# EAGLE design killbox (EAGLE 7.1.0)
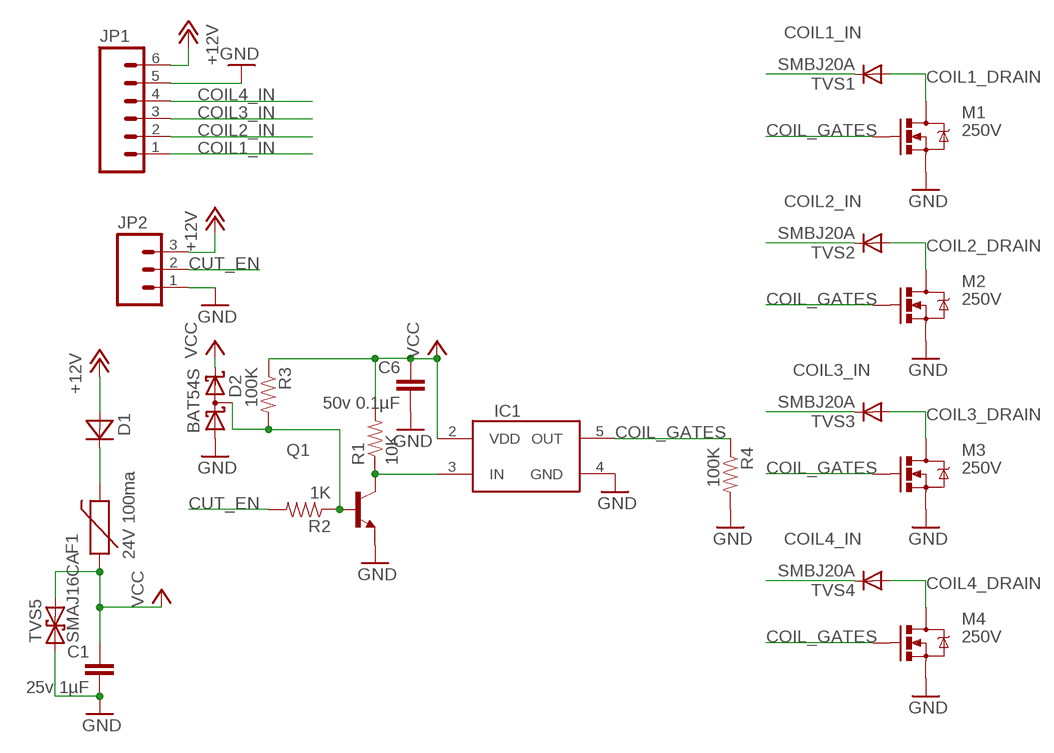
[diagram p0: schematic, sheet 1]

## Parts
C1  25v 1µF  CAP0603-CAP  [0603-CAP]
C6  50v 0.1µF  CAP0603-CAP  [0603-CAP]
D1  MBRA340T3  [SMA]
D2  BAT54S  [SOT23]
F1  24V 100ma  PTCSMD  [PTC-1206]
IC1  MCP1416  [SOT23-5]
JP1  M063.5MM-6  [SCREWTERMINAL-3.5MM-6]
JP2  M03-SCREW-5MM  [SCREWTERMINAL-5MM-3]
M1  250V  MOSFET-NCHANNELFDD8780  [DPAK]
M2  250V  MOSFET-NCHANNELFDD8780  [DPAK]
M3  250V  MOSFET-NCHANNELFDD8780  [DPAK]
M4  250V  MOSFET-NCHANNELFDD8780  [DPAK]
Q1  MMBT2222ALT1-NPN-SOT23-BEC  [SOT23-BEC]
R1  10K  RESISTOR0603-RES  [0603-RES]
R2  1K  RESISTOR0603-RES  [0603-RES]
R3  100K  RESISTOR0603-RES  [0603-RES]
R4  100K  RESISTOR0603-RES  [0603-RES]
TVS1  SMBJ20A  DIODESMB  [SMB-DIODE]
TVS2  SMBJ20A  DIODESMB  [SMB-DIODE]
TVS3  SMBJ20A  DIODESMB  [SMB-DIODE]
TVS4  SMBJ20A  DIODESMB  [SMB-DIODE]
TVS5  SMAJ16CA  TVS  [SMA-DIODE]

## Nets
+12V: D1.A JP1.6 JP2.3
COIL1_DRAIN [HV]: M1.4(D) TVS1.A
COIL1_IN [HV]: JP1.1 TVS1.C
COIL2_DRAIN [HV]: M2.4(D) TVS2.A
COIL2_IN [HV]: JP1.2 TVS2.C
COIL3_DRAIN [HV]: M3.4(D) TVS3.A
COIL3_IN [HV]: JP1.3 TVS3.C
COIL4_DRAIN [HV]: M4.4(D) TVS4.A
COIL4_IN [HV]: JP1.4 TVS4.C
COIL_GATES: IC1.5(OUT) M1.1(G) M2.1(G) M3.1(G) M4.1(G) R4.1
CUT_EN: JP2.2 R2.2
GND: C1.2 C6.2 D2.1(A1) IC1.4(GND) JP1.5 JP2.1 M1.3(S) M2.3(S) M3.3(S) M4.3(S) Q1.E R4.2 TVS5.A
N$1: IC1.3(IN) Q1.C R1.1
N$2: D2.3(C1A2) Q1.B R2.1 R3.2
N$11: D1.C F1.2
VCC: C1.1 C6.1 D2.2(C2) F1.1 IC1.2(VDD) R1.2 R3.1 TVS5.C

## Library data of the parts
C1 C6 = SparkFun-Passives:CAP: Capacitor Standard 0603 ceramic capacitor, and 0.1" leaded capacitor.
D1 = diode:MBRA340T3: Surface Mount Schottky Power Rectifier Source: http://www.onsemi.com/pub_link/Collateral/MBRA340T3-D.PDF
D2 = diode:BAT54S: Schottky Diodes Pin connection corrected 2011-05-04 Source: Fairchild .. BAT54.pdf
F1 = SparkFun-PowerIC:PTC: Resettable Fuse PTC Resettable Fuse. Spark Fun Electronics SKU : COM-08357; PROD_ID: RES-11150
IC1 = misc:MCP1416
JP1 = SparkFun-Connectors:M06: Header 6 Standard 6-pin 0.1" header. Use with straight break away headers (SKU : PRT-00116), right angle break away headers (PRT-00553), swiss pins (PRT-00743), machine pins (PRT-00117), and female headers (PRT-00115). Molex polarized connector foot print use with SKU : PRT-08094 with associated crimp pins and housings. NOTES ON THE VARIANTS LOCK and LOCK_LONGPADS... This footprint was designed to help hold the alignment of a through-hole component (i.e. 6-pin header) while soldering it into place. You may notice that each hole has been shifted either up or down by 0.005 of an inch from it's more standard position (which is a perfectly straight line). This slight alteration caused the pins (the squares in the middle) to touch the edges of the holes. Because they are alternating, it causes a "brace" to hold the component in place. 0.005 has proven to be the perfect amount of "off-center" position when using our standard breakaway headers. Although looks a little odd when you look at the bare footprint, once you have a header in there, the alteration is very hard to notice. Also,if you push a header all the way into place, it is covered up entirely on the bottom side. This idea of altering the position of holes to aid alignment will be further integrated into the Sparkfun Library for other footprints. It can help hold any component with 3 or more connection pins.
JP2 = SparkFun-Connectors:M03: Header 3 Standard 3-pin 0.1" header. Use with straight break away headers (SKU : PRT-00116), right angle break away headers (PRT-00553), swiss pins (PRT-00743), machine pins (PRT-00117), and female headers (PRT-00115). Molex polarized connector foot print use with SKU : PRT-08232 with associated crimp pins and housings.
M1-M4 = SparkFun-DiscreteSemi:MOSFET-NCHANNEL: Common NMOSFET Parts MFG P/N Store ID Prod ID FDD8780 TRANS-09984 SI7820DN TRANS-11055 FDS6630A IC-08089 2N7002PW TRANS-11151 FQP30N06L COM-10213 TRANS-10060 BSS123LT1G TRANS-08345 BSS138 TRANS-00830 BS170 2N7000; PROD_ID: TRANS-09984
Q1 = transistor:*-NPN-: NPN Transistror BF959 corrected 2008.03.06
R1-R4 = SparkFun-Passives:RESISTOR: Resistor Basic schematic elements and footprints for 0603, 1206, and PTH resistors.
TVS1-TVS4 = SparkFun-DiscreteSemi:DIODE: Diode These are standard reverse protection diodes and small signal diodes. SMA package can handle up to about 1A. SOD-323 can handle about 200mA. What the SOD-323 package when ordering, there are some mfgs out there that are 5-pin packages.
TVS5 = SparkFun-DiscreteSemi:TVS: Transient voltage suppressor- prevents ESD on inputs. Ignore package description- MBRA140 is NOT this type of part!!!

## Net classes
0 default: clearance 0.3 mm
1 HV: width 0.5 mm, clearance 0.8 mm

## Board
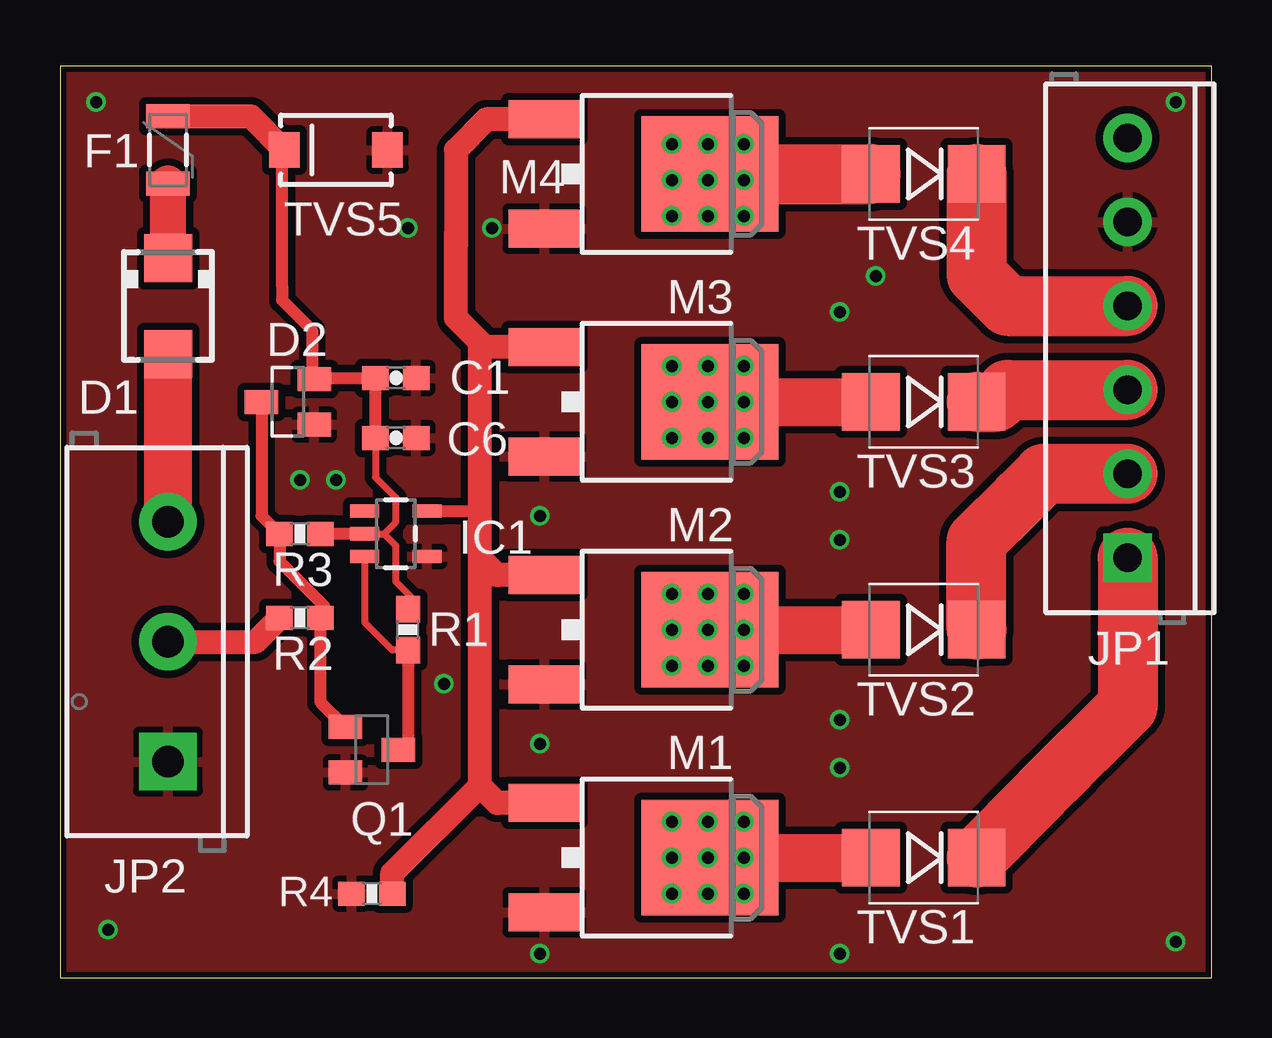
[diagram p1: board, top side]
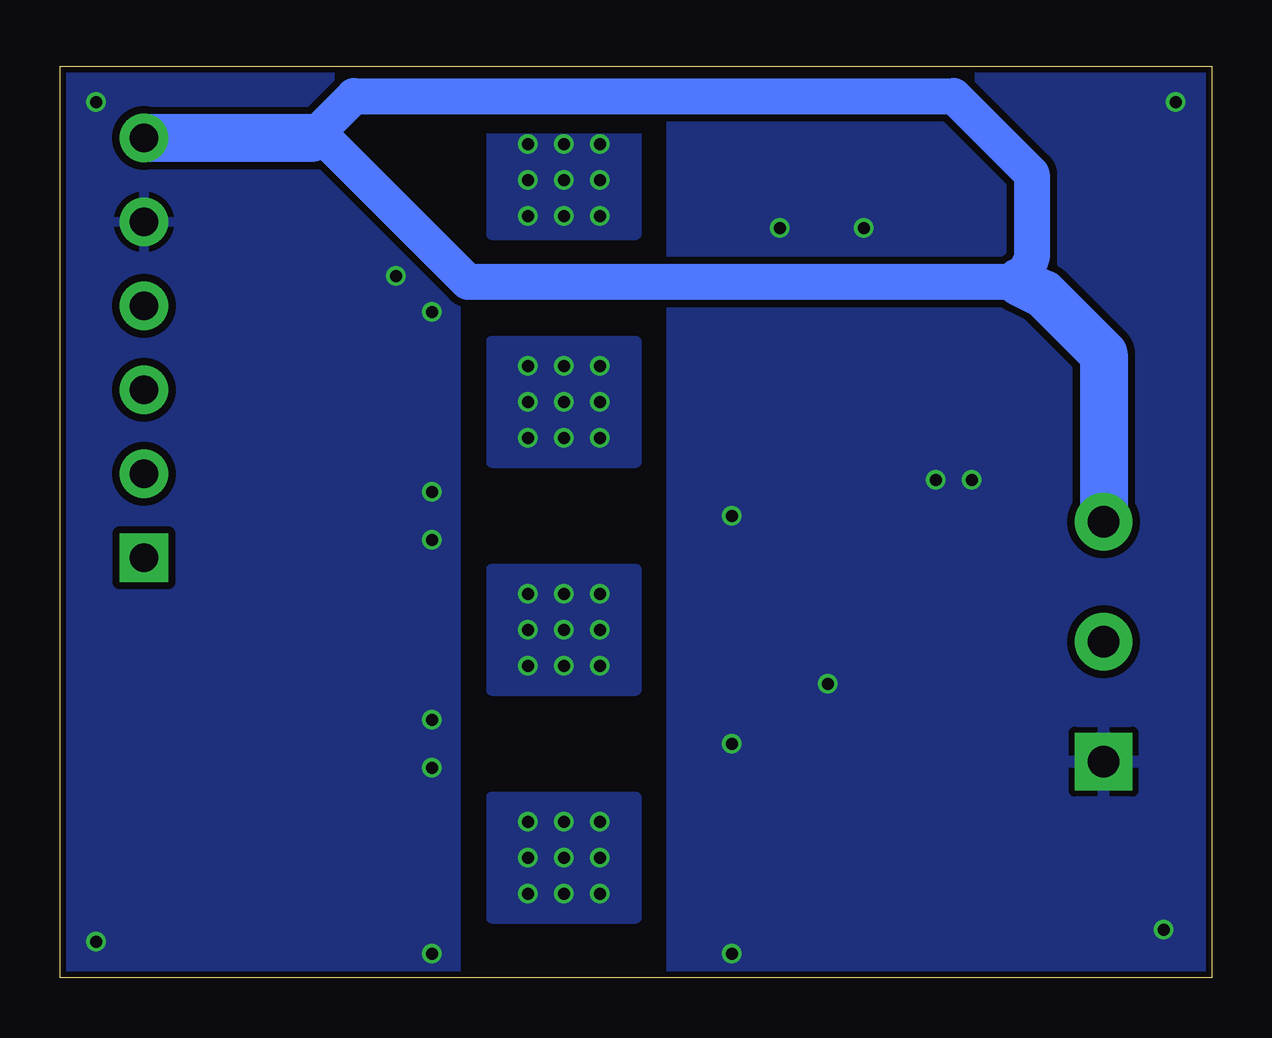
[diagram p2: board, bottom side, seen from below]

Size 48 x 38 mm. Coordinates in mm from the lower left corner, seen from the top.
Outline: 0,0 48,0
Outline: 48,0 48,38 0,38 0,0
Outline: 0,0 48,0
Copper layers (1*16): Top 0.035mm / dielectric 1.5mm / Bottom 0.035mm
Design rules "SeeedStudio_2layer_DRU_no_angle_20140221": minimum track width 6mil, minimum drill 12mil, track to track 6mil, track to pad 6mil, pad to pad 6mil, via to via 6mil, smd to smd 0mil, copper to edge 10mil, drill to drill 10mil, minimum pad ring 10mil, minimum via ring 6mil, stop-mask expansion 2mil, vias tented up to drill 100mil, thermal gap 10mil

### Footprints (pad centres in the part's own frame; a part is rotated, then mirrored left to right if it is on the bottom)
0603-CAP = smd 1.1 x 1: 1 -0.85,0; 2 0.85,0
SMA = smd 2 x 2: A 2,0; C -2,0
SOT23 = smd 1 x 1.4: 1 -0.95,-1.1; 2 0.95,-1.1; 3 0,1.1
PTC-1206 = smd 1 x 1.8: 1 -1.4,0; 2 1.4,0
SOT23-5 = smd 0.55 x 1.2: 1 -0.95,-1.3; 2 0,-1.3; 3 0.95,-1.3; 4 0.95,1.3; 5 -0.95,1.3
SCREWTERMINAL-3.5MM-6 = drill 1.2 pad 2.032 square: 1 0,0 | drill 1.2 pad 2.032: 2 3.5,0; 3 7,0; 4 10.5,0; 5 14,0; 6 17.5,0
SCREWTERMINAL-5MM-3 = drill 1.3 pad 2.413 square: 1 0,0 | drill 1.3 pad 2.413: 2 5,0; 3 10,0
DPAK = smd 1.6 x 3: 1 -2.28,-5.31; 3 2.28,-5.31 | smd 4.826 x 5.715: 4 0,1.588
SOT23-BEC = smd 1 x 1.4: B -0.95,-1.1; C 0,1.1; E 0.95,-1.1
0603-RES = smd 1.1 x 1: 1 -0.85,0; 2 0.85,0
SMB-DIODE = smd 2.4 x 2.4: A 2.2,0; C -2.2,0
SMA-DIODE = smd 1.27 x 1.47: A -2.15,0; C 2.15,0

### Placement (x,y rotation side)
C1  14,25 0 top
C6  14,22.5 0 top
D1  4.5,28 270 top
D2  9.5,24 90 top
F1  4.5,34.5 270 top
IC1  14,18.5 270 top
JP1  44.5,17.5 90 top
JP2  4.5,9 90 top
M1  25.5,5 270 top
M2  25.5,14.5 270 top
M3  25.5,24 270 top
M4  25.5,33.5 270 top
Q1  13,9.5 270 top
R1  14.5,14.5 90 top
R2  10,15 180 top
R3  10,18.5 180 top
R4  13,3.5 180 top
TVS1  36,5 180 top
TVS2  36,14.5 180 top
TVS3  36,24 180 top
TVS4  36,33.5 180 top
TVS5  11.5,34.5 180 top

### Tracks (layer width: path | path; a pad name or v marks a point on that pad's centre or on a via)
+12V
  Top 2: JP2.3 D1.A
  Bottom 1.5: 35.75,36.75 10.75,36.75 7.5,33.5 7.5,30 8,29 31,29 37,35 37.5,35 35.75,36.75
  Bottom 2: 8,29 7,28.5 D1.A JP2.3 | 37.5,35 JP1.6
COIL1_DRAIN  (via drill 0.5)
  Top 1: M1.4 v27,5
  Top 2: M1.4 TVS1.A
  other vias: 25.5,6.5 27,6.5 28.5,6.5 28.5,3.5 27,3.5 25.5,3.5 28.5,5 25.5,5
  pour Bottom: 24,7.5 30,7.5 30,2.5 24,2.5
COIL1_IN
  Top 2.5: 42,8.8 40.85,7.65 | 40.85,7.65 TVS1.C | JP1.1 44.5,11.3 40.85,7.65
COIL2_DRAIN  (via drill 0.5)
  Top 1: M2.4 v27,14.5
  Top 2: M2.4 TVS2.A
  other vias: 25.5,16 25.5,13 27,16 28.5,16 28.5,13 27,13 25.5,14.5 28.5,14.5
  pour Bottom: 24,17 30,17 30,12 24,12
COIL2_IN
  Top 2.5: TVS2.C 38.2,18.2 40,20 41,21 JP1.2
COIL3_DRAIN  (via drill 0.5)
  Top 1: M3.4 v27,24
  Top 2: M3.4 TVS3.A
  other vias: 25.5,25.5 25.5,22.5 27,25.5 28.5,25.5 28.5,22.5 27,22.5 25.5,24 28.5,24
  pour Bottom: 24,26.5 30,26.5 30,21.5 24,21.5
COIL3_IN
  Top 2.5: TVS3.C 39,24 39.5,24.5 JP1.3
COIL4_DRAIN  (via drill 0.5)
  Top 1: v27,33.25 27,33.41 M4.4
  Top 2.5: M4.4 TVS4.A
  other vias: 25.5,31.75 27,31.75 28.5,31.75 25.5,33.25 28.5,33.25 25.5,34.75 27,34.75 28.5,34.75
  pour Bottom: 24,35.25 30,35.25 30,31 24,31
COIL4_IN
  Top 2.5: TVS4.C 38.2,29.3 39.5,28 JP1.4
COIL_GATES
  Top 0.5: IC1.5 17.45,19.45 17.5,19.5
  Top 1: M4.1 17.78,35.78 16.5,34.5 16.5,31 | 16.5,31 16.5,30.5 | M3.1 17.72,26.28 17.25,26.75 | 17.25,26.75 16.5,27.5 16.5,31 | M2.1 18.22,16.78 17.5,17.5 17.5,18.5 | 17.5,18.5 17.5,19.5 17.5,26.5 17.25,26.75 | M1.1 18.22,7.28 17.5,8 | 17.5,8 17.5,18.5 | R4.1 13.85,4.35 17.5,8
CUT_EN
  Top 1: JP2.2 8.15,14 R2.2
GND  (via drill 0.5)
  other vias: 46.5,36.5 46.5,1.5 2,2 1.5,36.5 20,19.25 18,31.25 20,9.75 16,12.25 14.5,31.25 10,20.75 11.5,20.75 32.5,20.25 32.5,27.75 32.5,8.75 32.5,18.25 32.5,10.75 34,29.25 32.5,1 20,1
  pour Top: 0,38 48,38 48,0 0,0
  pour Bottom: 31.5,38 48,38 48,0 31.5,0
  pour Bottom: 0,38 22.5,38 22.5,0 0,0
N$1
  Top 0.3: IC1.3 12.7,14.8 13,14.5 13.85,13.65 R1.1
  Top 0.5: R1.1 14.5,9.9 Q1.C
N$2
  Top 0.5: D2.3 8.4,19.25 R3.2 9.15,17.35 11,15.5 11,15.15 R2.1 10.85,11.5 Q1.B
N$11
  Top 1.5: D1.C F1.2
VCC
  Top 0.3: IC1.2 13.5,18.5 | 13.5,18.5 14,19 14,20 13.15,20.85 C6.1 | R1.2 14.65,15.85 14,16.5 14,18 13.5,18.5 | 10.55,25 D2.2
  Top 0.5: C6.1 13.15,24.95 C1.1 10.55,25 | IC1.2 R3.1 | TVS5.C 9.25,34.4 9.25,28.85 9.25,28.25 10.5,27 10.5,25.05 D2.2
  Top 1: F1.1 7.95,35.9 TVS5.C